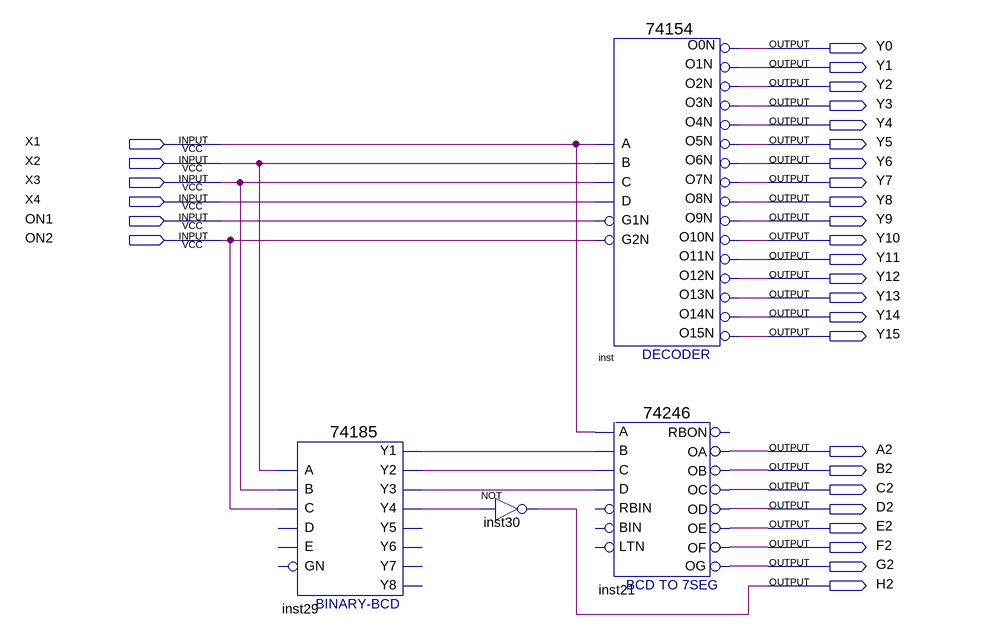
[diagram p0: schematic sheet]
// Quartus schematic cmb2.bdf as structural Verilog: 4 symbols, 30 pins
module cmb2 (
  input  X1,
  input  X2,
  input  X3,
  input  X4,
  input  ON1,
  input  ON2,
  output Y0,
  output Y1,
  output Y2,
  output Y3,
  output Y4,
  output Y5,
  output Y6,
  output Y7,
  output Y8,
  output Y9,
  output Y10,
  output Y11,
  output Y12,
  output Y13,
  output Y14,
  output Y15,
  output A2,
  output B2,
  output C2,
  output D2,
  output E2,
  output F2,
  output G2,
  output H2
);

  wire inst29_y1, inst29_y2, inst29_y3, inst29_y4;

  \74185  inst29 (
    .A(X2), .B(X3), .C(ON2), .Y1(inst29_y1), .Y3(inst29_y3), .Y2(inst29_y2), .Y4(inst29_y4));  // open: D, E, GN, Y5, Y6, Y8, Y7
  not inst30 (H2, inst29_y4);
  \74154  inst (
    .C(X3), .D(X4), .B(X2), .A(X1), .G1N(ON1), .G2N(ON2), .O0N(Y0), .O12N(Y12), .O15N(Y15), .O10N(Y10),
    .O11N(Y11), .O1N(Y1), .O13N(Y13), .O14N(Y14), .O4N(Y4), .O3N(Y3), .O2N(Y2), .O7N(Y7), .O6N(Y6), .O5N(Y5),
    .O9N(Y9), .O8N(Y8));
  \74246  inst21 (
    .B(inst29_y1), .A(X1), .D(inst29_y3), .C(inst29_y2), .OD(D2), .OC(C2), .OB(B2), .OE(E2), .OF(F2),
    .OA(A2), .OG(G2));  // open: RBIN, LTN, BIN, RBON
endmodule
